# EasyEDA schematic 1-Schematic_Remote1000.json
TITLE: Remote1000; REV: 1.0; Date: 2024-07-13; Sheet: 1/1; Drawn By: sbernardotti; Company: Remote1000
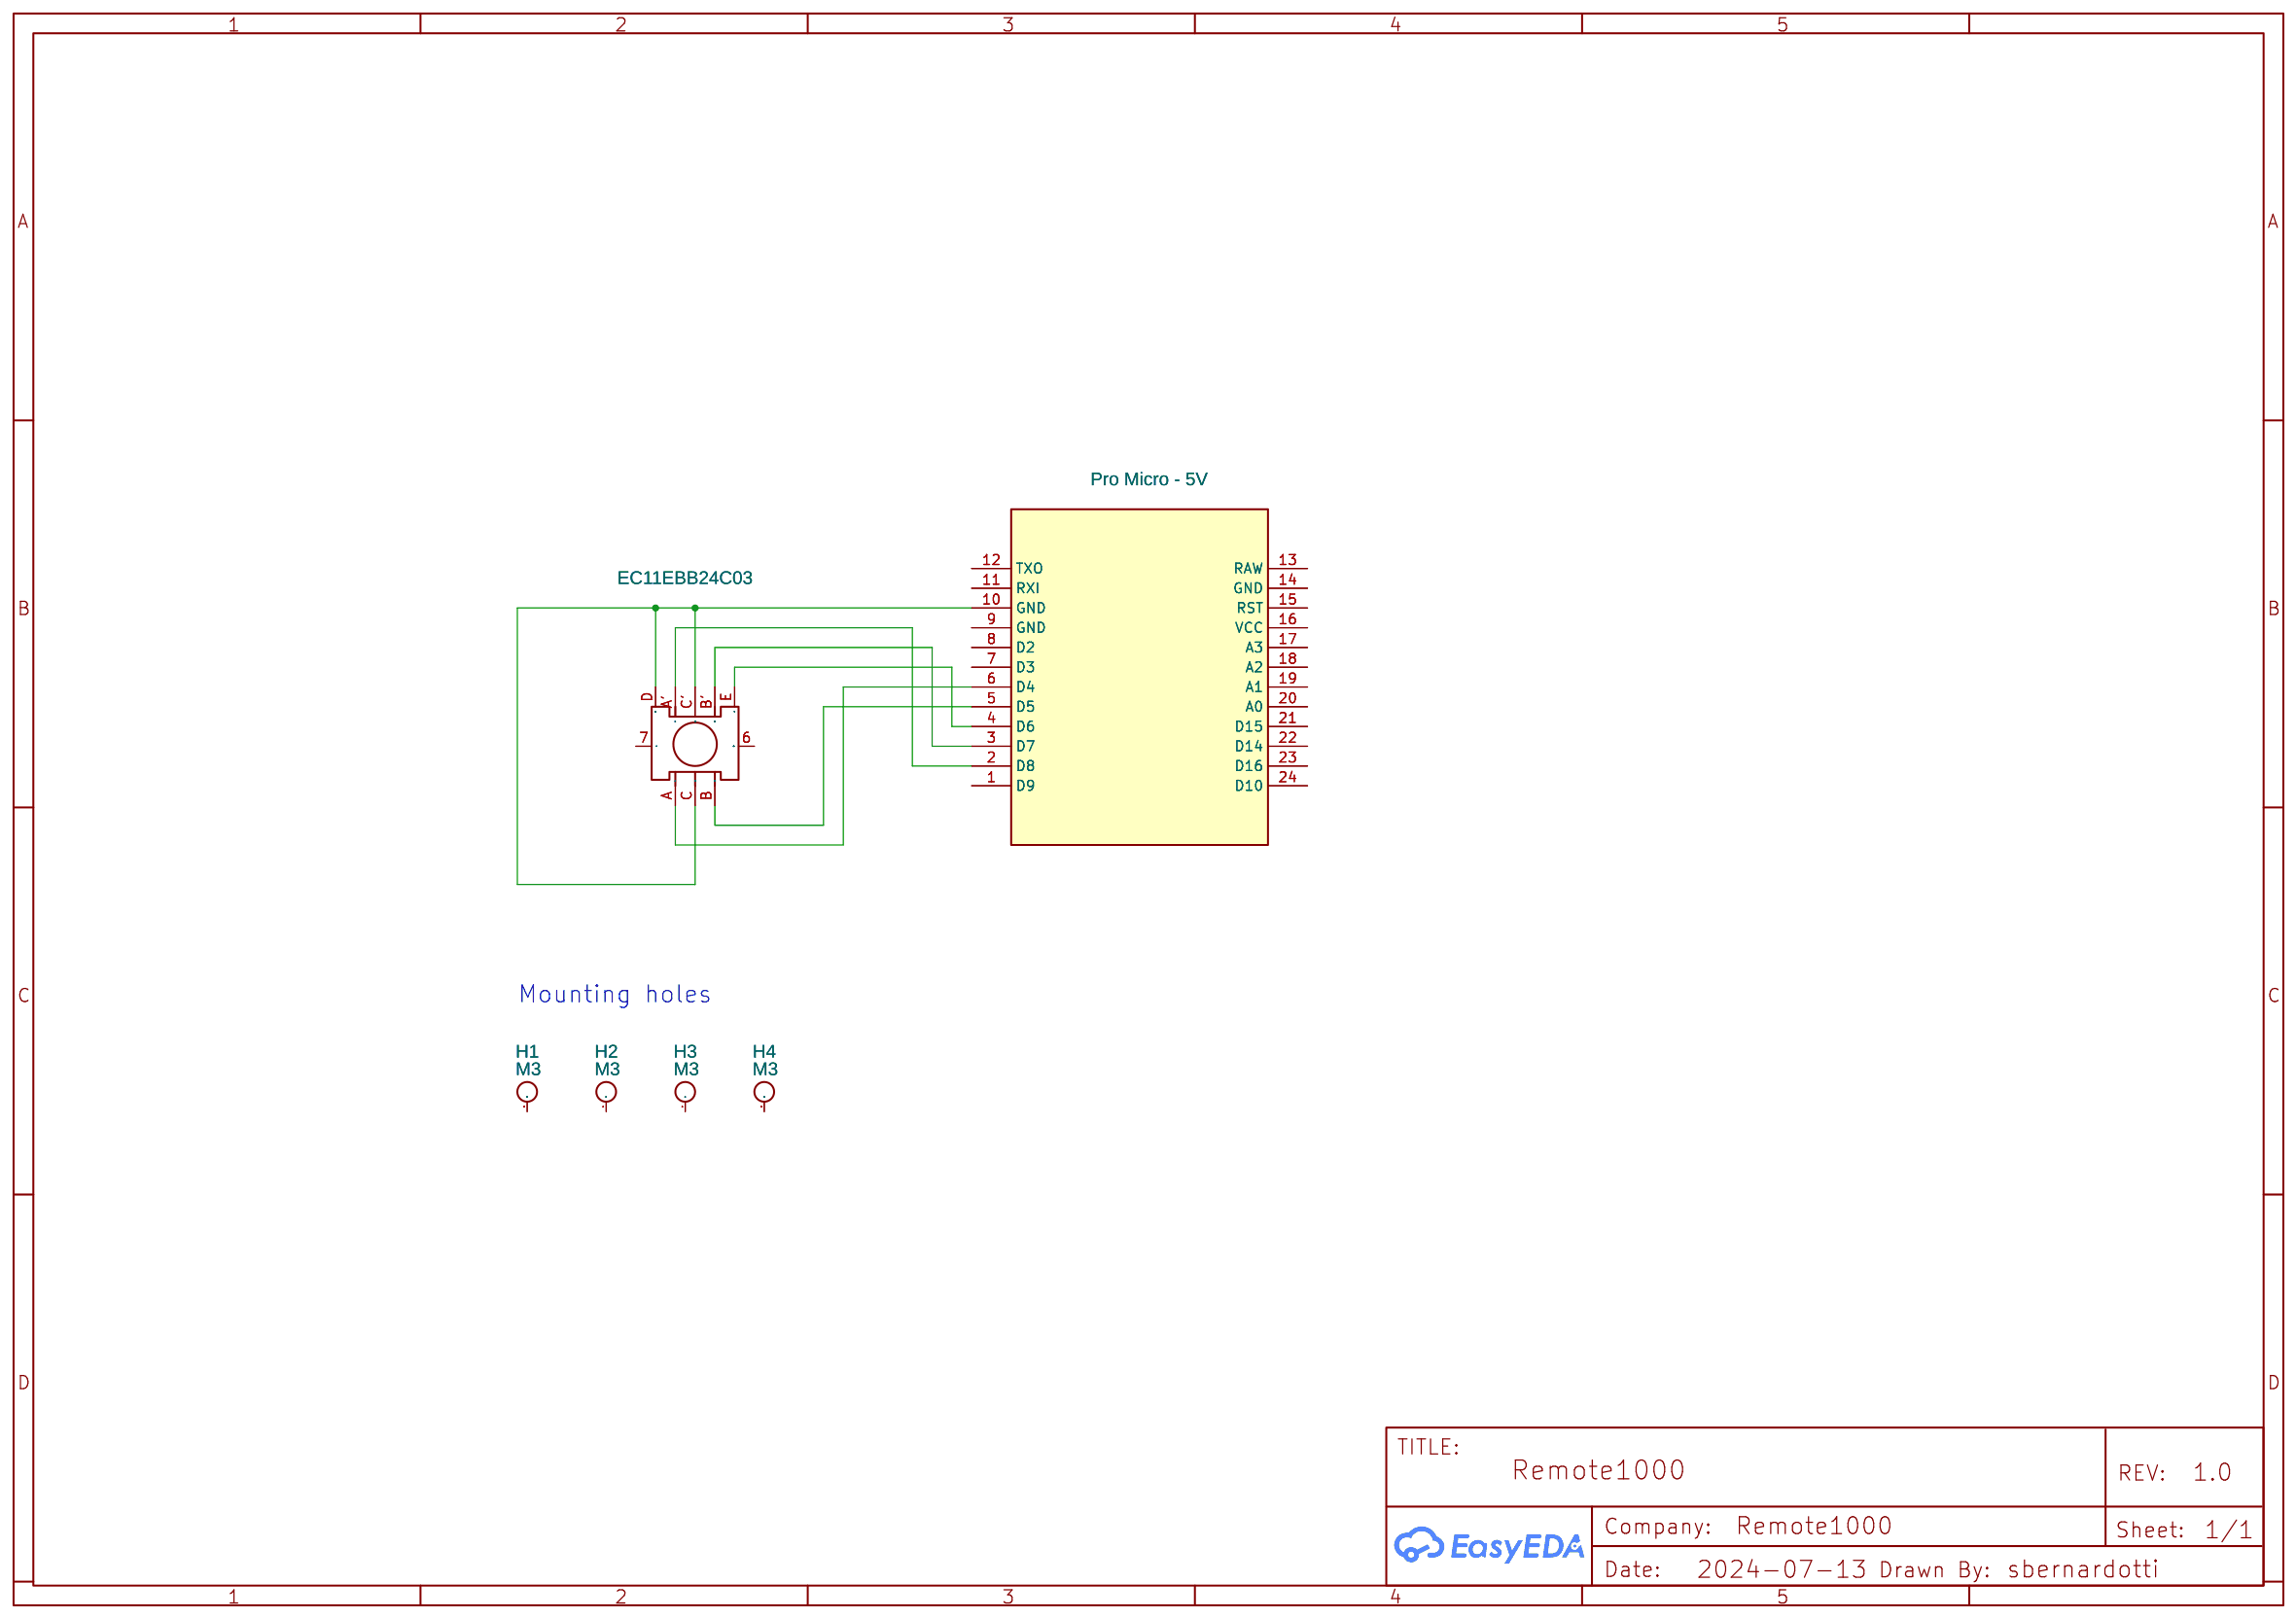
[diagram p0: schematic sheet]

## Parts
H1  M3  [HOLE_D3M5_D7M0_MOUNTING_HOLE]
H2  M3  [HOLE_D3M5_D7M0_MOUNTING_HOLE]
H3  M3  [HOLE_D3M5_D7M0_MOUNTING_HOLE]
H4  M3  [HOLE_D3M5_D7M0_MOUNTING_HOLE]
P1  Pro Micro - 5V  [PRO MICRO - 5V]
SW1  EC11EBB24C03  [SW-TH_EC11EBB24C03]

## Library data of the parts
H1-H4 = HOLE_D3M5_D7M0_PCB_MOUNTING: Contributor: MobiFlight; sourceId: zBJD82WQ8
P1 = Pro Micro - 5V: sourceId: 1T5FDZYC8
SW1 = EC11EBB24C03: Contributor: LCSC; Supplier: LCSC; Supplier Part: C470790; Manufacturer: ALPSALPINE(阿尔卑斯阿尔派); JLCPCB Part Class: Extended Part

## Nets
Net-(P1-2): P1.2(D8) SW1.A'
Net-(P1-3): P1.3(D7) SW1.B'
Net-(P1-4): P1.4(D6) SW1.E
Net-(P1-5): P1.5(D5) SW1.B
Net-(P1-6): P1.6(D4) SW1.A
Net-(P1-10): P1.10(GND) SW1.C SW1.C' SW1.D

Not connected (* = marked no-connect by the designer): H1 1; H2 1; H3 1; H4 1; P1 1(D9) 7(D3) 8(D2) 9(GND) 11(RXI) 12(TXO) 13(RAW) 14(GND) 15(RST) 16(VCC) 17(A3) 18(A2) 19(A1) 20(A0) 21(D15) 22(D14) 23(D16) 24(D10); SW1 6 7

## Notes on the sheet
- Mounting holes
